# Altium project IO_Driver1616.PrjPCB
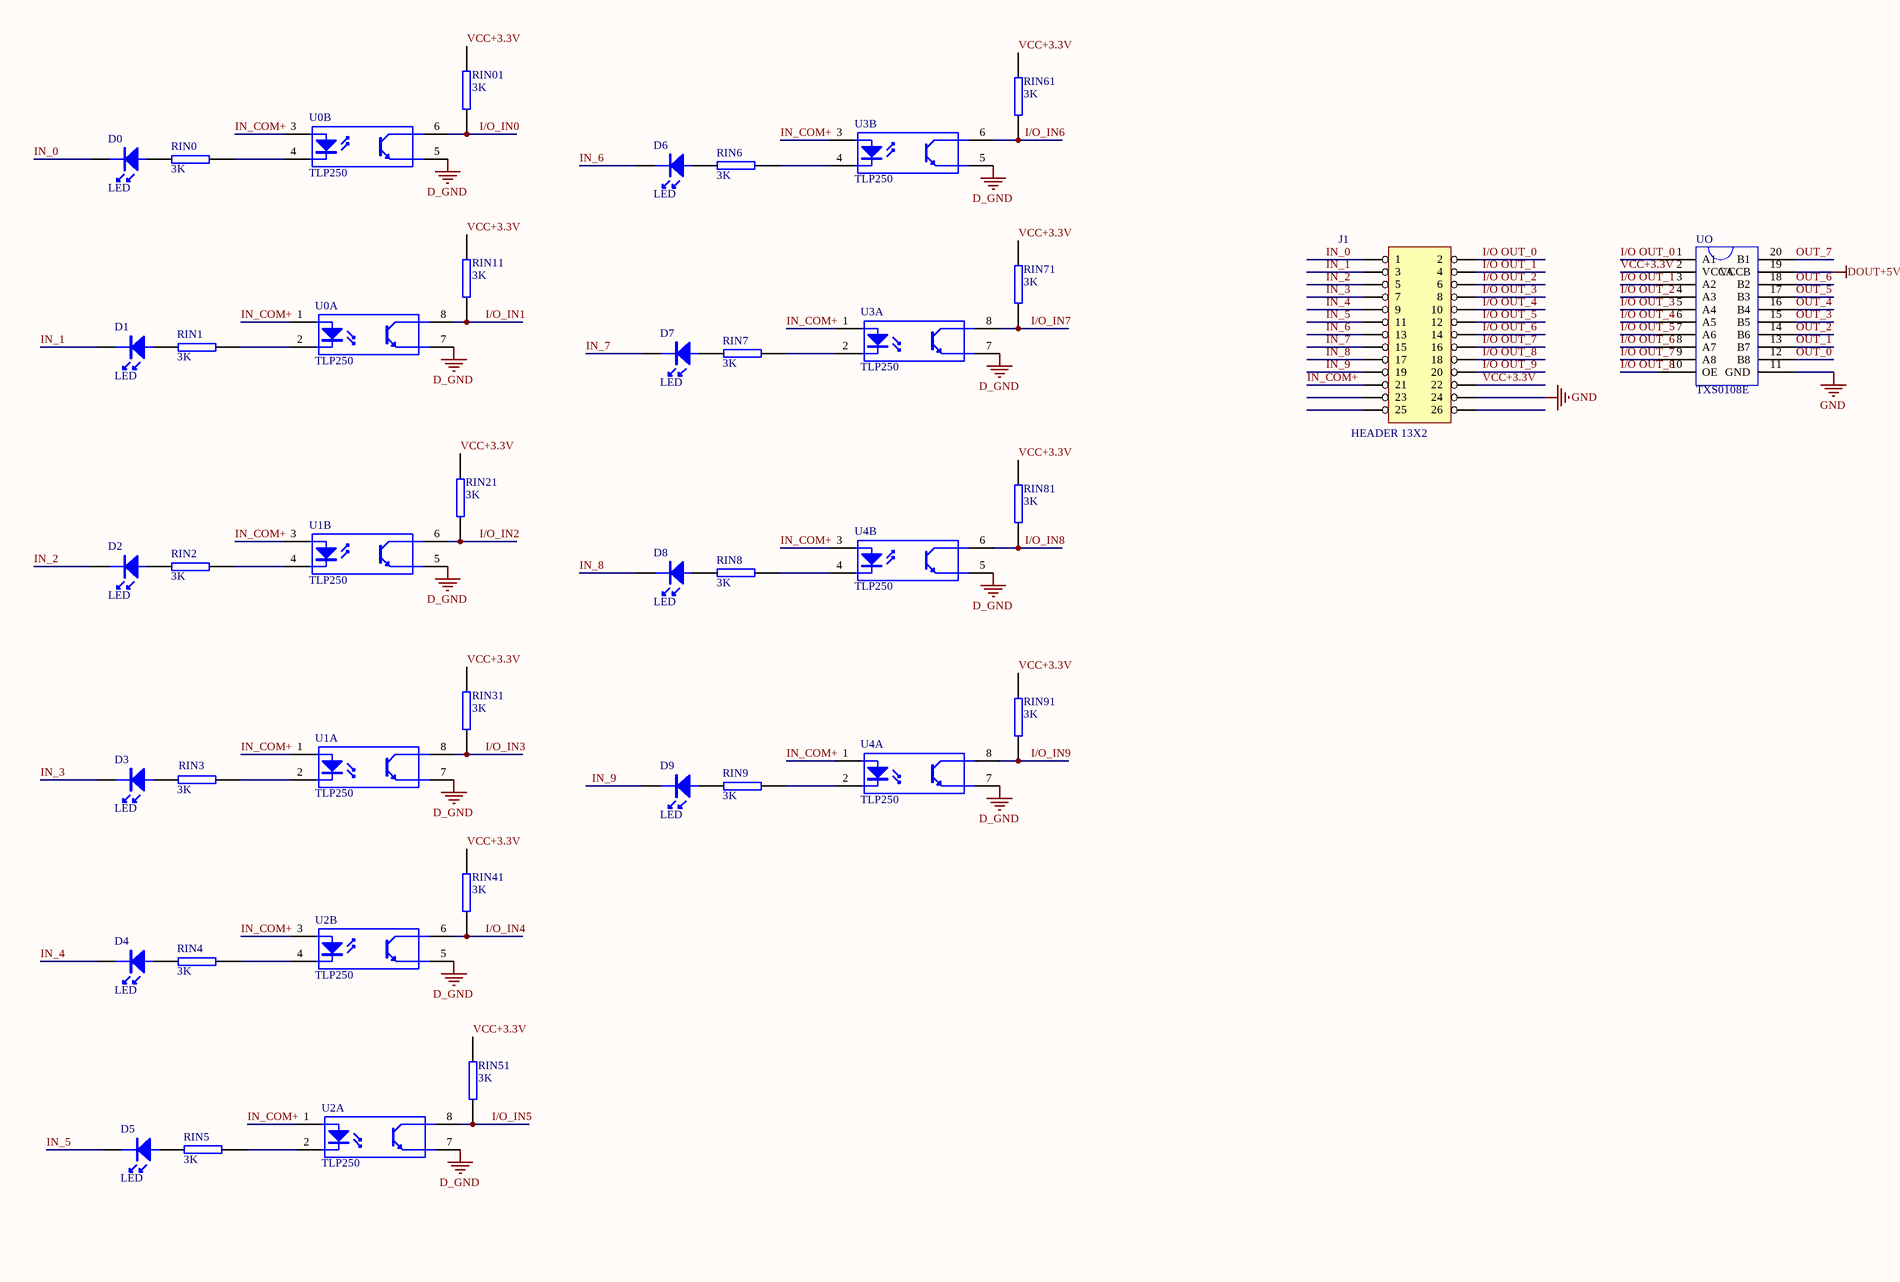
[diagram p0: IO_Driver1616.SchDoc, left]
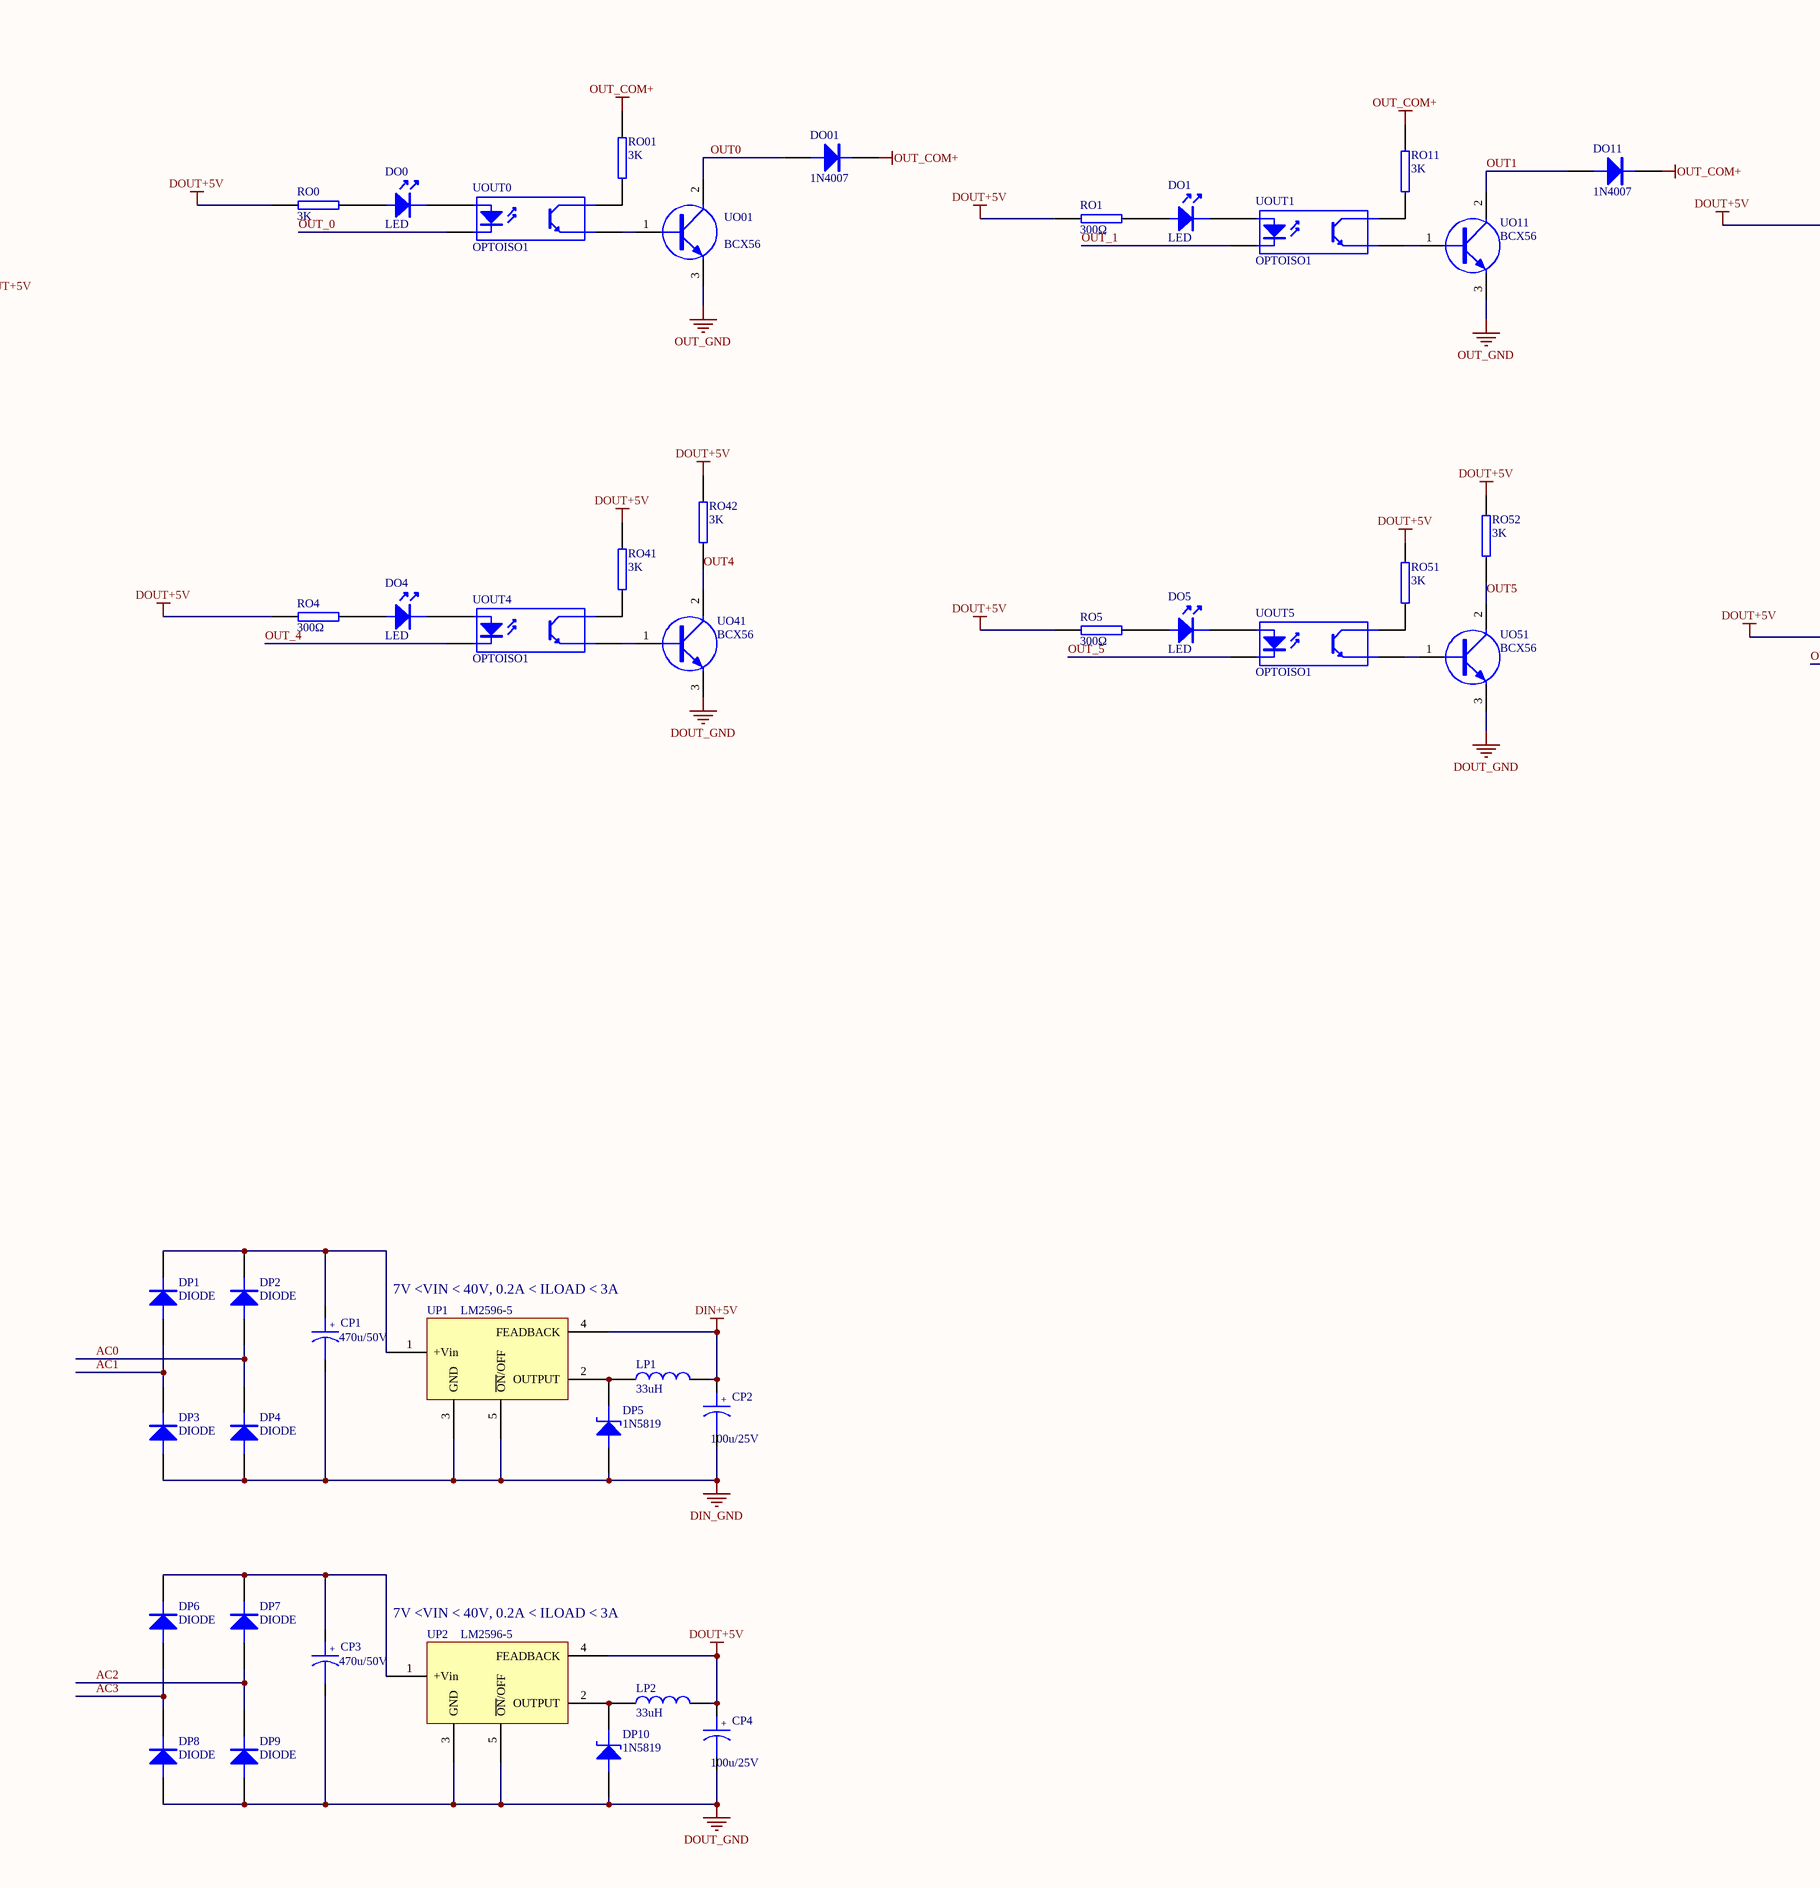
[diagram p1: IO_Driver1616.SchDoc, middle]
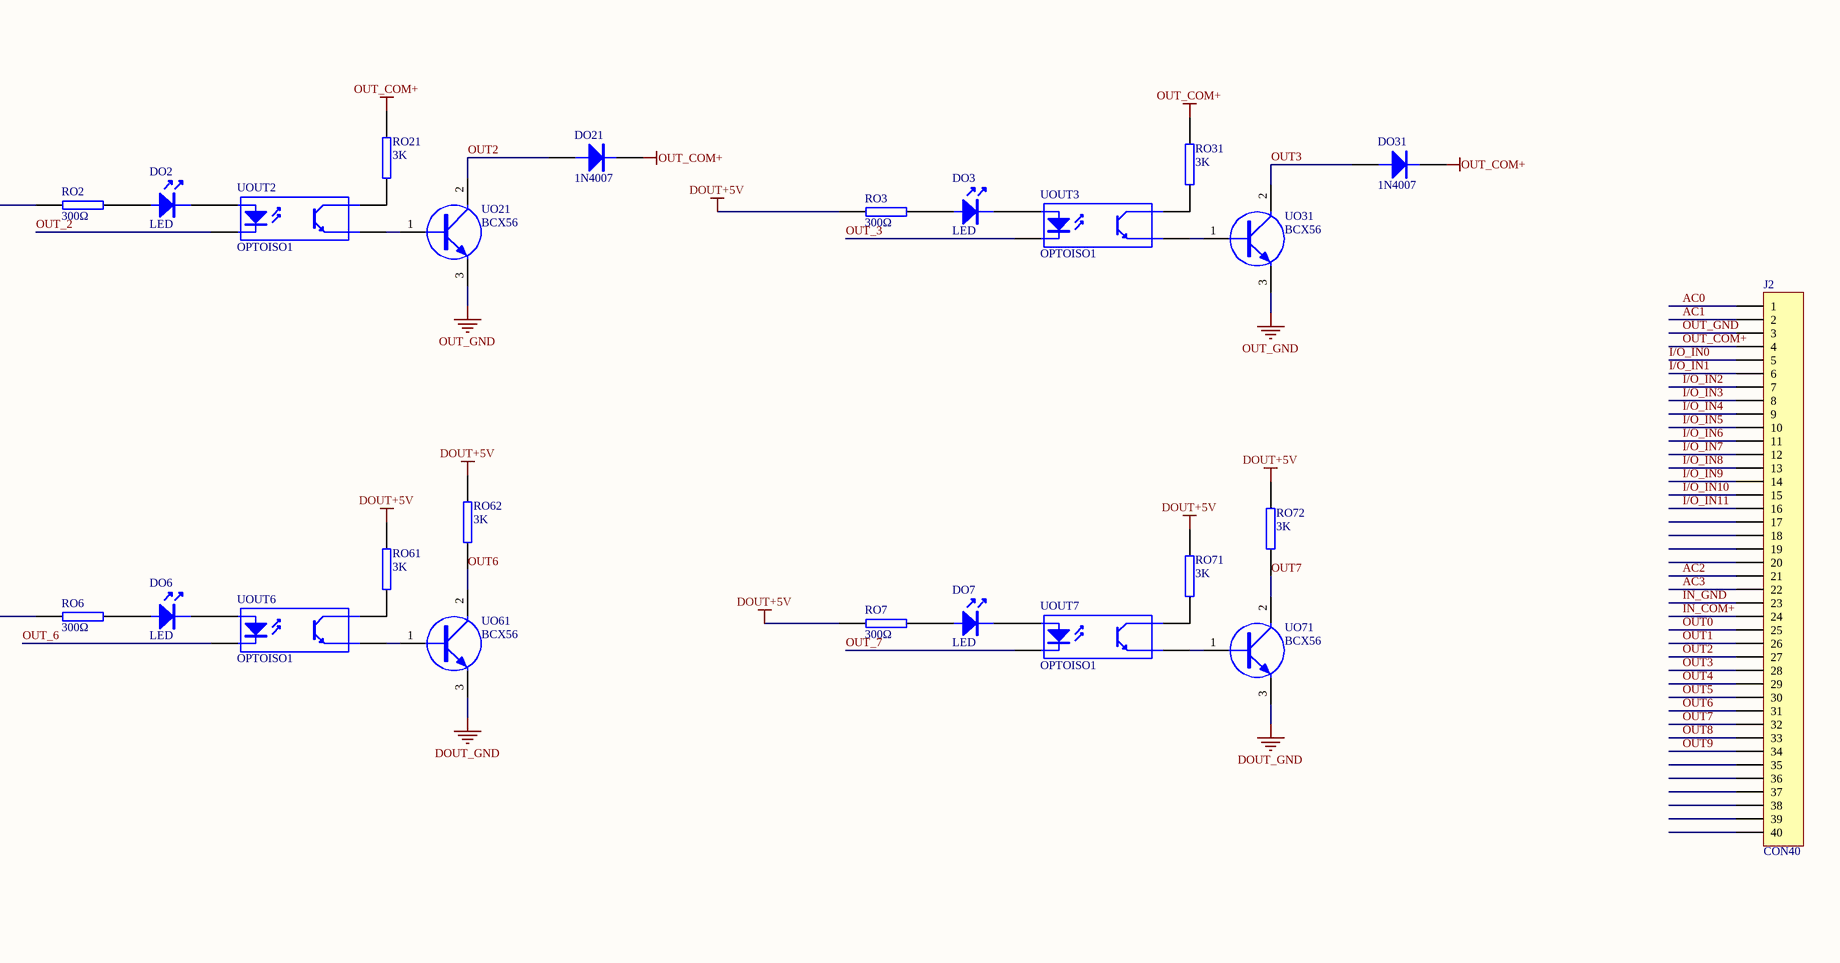
[diagram p2: IO_Driver1616.SchDoc, right]
1 sheet, 104 parts. Net scope: global (net labels, ports and power ports of the same name join across sheets).
Board file: IO_Driver1616.PcbDoc

## Sheet IO_Driver1616.SchDoc
size A0

### Parts
CP1  470u/50V  [RB.2/.4]
CP2  100u/25V  [7343]
CP3  470u/50V  [RB.2/.4]
CP4  100u/25V  [7343]
D0  LED  [LED-1]
D1  LED  [LED-1]
D2  LED  [LED-1]
D3  LED  [LED-1]
D4  LED  [LED-1]
D5  LED  [LED-1]
D6  LED  [LED-1]
D7  LED  [LED-1]
D8  LED  [LED-1]
D9  LED  [LED-1]
DO0  LED  [LED-1]
DO01  1N4007  [sma]
DO1  LED  [LED-1]
DO2  LED  [LED-1]
DO3  LED  [LED-1]
DO4  LED  [LED-1]
DO5  LED  [LED-1]
DO6  LED  [LED-1]
DO7  LED  [LED-1]
DO11  1N4007  [sma]
DO21  1N4007  [sma]
DO31  1N4007  [sma]
DP1  DIODE  [4007]
DP2  DIODE  [4007]
DP3  DIODE  [4007]
DP4  DIODE  [4007]
DP5  1N5819  [sma]
DP6  DIODE  [4007]
DP7  DIODE  [4007]
DP8  DIODE  [4007]
DP9  DIODE  [4007]
DP10  1N5819  [sma]
J1  HEADER 13X2  [IDC26 -2.0]
J2  CON40  [KF7.62-40p]
LP1  33uH  [L-5×5]
LP2  33uH  [L-5*5]
RIN0  3K  [0805]
RIN1  3K  [0805]
RIN01  3K  [0805]
RIN2  3K  [0805]
RIN3  3K  [0805]
RIN4  3K  [0805]
RIN5  3K  [0805]
RIN6  3K  [0805]
RIN7  3K  [0805]
RIN8  3K  [0805]
RIN9  3K  [0805]
RIN11  3K  [0805]
RIN21  3K  [0805]
RIN31  3K  [0805]
RIN41  3K  [0805]
RIN51  3K  [0805]
RIN61  3K  [0805]
RIN71  3K  [0805]
RIN81  3K  [0805]
RIN91  3K  [0805]
RO0  3K  [0805]
RO01  3K  [0805]
RO1  300Ω  [0805]
RO2  300Ω  [0805]
RO3  300Ω  [0805]
RO4  300Ω  [0805]
RO5  300Ω  [0805]
RO6  300Ω  [0805]
RO7  300Ω  [0805]
RO11  3K  [0805]
RO21  3K  [0805]
RO31  3K  [0805]
RO41  3K  [0805]
RO42  3K  [0805]
RO51  3K  [0805]
RO52  3K  [0805]
RO61  3K  [0805]
RO62  3K  [0805]
RO71  3K  [0805]
RO72  3K  [0805]
U0  TLP250  [DIP8]  (parts A,B of 2)
U1  TLP250  [DIP8]  (parts A,B of 2)
U2  TLP250  [DIP8]  (parts A,B of 2)
U3  TLP250  [DIP8]  (parts A,B of 2)
U4  TLP250  [DIP8]  (parts A,B of 2)
UO  TXS0108E  [TXS0108E]
UO01  BCX56  [SOP-89]
UO11  BCX56  [SOP-89]
UO21  BCX56  [SOP-89]
UO31  BCX56  [SOP-89]
UO41  BCX56  [SOP-89]
UO51  BCX56  [SOP-89]
UO61  BCX56  [SOP-89]
UO71  BCX56  [SOP-89]
UOUT0  OPTOISO1  [SO4]
UOUT1  OPTOISO1  [SO4]
UOUT2  OPTOISO1  [SO4]
UOUT3  OPTOISO1  [SO4]
UOUT4  OPTOISO1  [SO4]
UOUT5  OPTOISO1  [SO4]
UOUT6  OPTOISO1  [SO4]
UOUT7  OPTOISO1  [SO4]
UP1  LM2596-5  [HRP5]
UP2  LM2596-5  [HRP5]

### Nets
D_GND: U0.5(E) U0.7(E) U1.5(E) U1.7(E) U2.5(E) U2.7(E) U3.5(E) U3.7(E) U4.5(E) U4.7(E)
DIN+5V: CP2.1 LP1.2 UP1.4(FEADBACK)
DIN_GND: CP1.2 CP2.2 DP3.1 DP4.1 DP5.1(A) UP1.3(GND) UP1.5(~{ON}/OFF)
DOUT+5V: CP4.1 LP2.2 RO0.1 RO1.1 RO2.1 RO3.1 RO4.1 RO5.1 RO6.1 RO7.1 RO41.1 RO42.1 RO61.1 RO62.1 RO71.1 RO72.1 UO.19(VCCB) UP2.4(FEADBACK)
DOUT_GND: CP3.2 CP4.2 DP8.1 DP9.1 DP10.1(A) UO41.3(E) UO51.3(E) UO61.3(E) UO71.3(E) UP2.3(GND) UP2.5(~{ON}/OFF)
GND: J1.24 UO.11(GND)
OUT_COM+: DO01.2 DO11.2 DO21.2 DO31.2 J2.4 RO01.1 RO11.1 RO21.1 RO31.1
OUT_GND: J2.3 UO01.3(E) UO11.3(E) UO21.3(E) UO31.3(E)
AC0: DP2.1 DP4.2 J2.1
AC1: DP1.1 DP3.2 J2.2
AC2: DP7.1 DP9.2 J2.21
AC3: DP6.1 DP8.2 J2.22
I/O OUT_0: J1.2 UO.1(A1)
I/O OUT_1: J1.4 UO.3(A2)
I/O OUT_2: J1.6 UO.4(A3)
I/O OUT_3: J1.8 UO.5(A4)
I/O OUT_4: J1.10 UO.6(A5)
I/O OUT_5: J1.12 UO.7(A6)
I/O OUT_6: J1.14 UO.8(A7)
I/O OUT_7: J1.16 UO.9(A8)
I/O OUT_8: J1.18 UO.10(OE)
I/O OUT_9: J1.20
I/O_IN0: J2.5 RIN01.2 U0.6(C)
I/O_IN1: J2.6 RIN11.2 U0.8(C)
I/O_IN2: J2.7 RIN21.2 U1.6(C)
I/O_IN3: J2.8 RIN31.2 U1.8(C)
I/O_IN4: J2.9 RIN41.2 U2.6(C)
I/O_IN5: J2.10 RIN51.2 U2.8(C)
I/O_IN6: J2.11 RIN61.2 U3.6(C)
I/O_IN7: J2.12 RIN71.2 U3.8(C)
I/O_IN8: J2.13 RIN81.2 U4.6(C)
I/O_IN9: J2.14 RIN91.2 U4.8(C)
I/O_IN10: J2.15
I/O_IN11: J2.16
IN_0: D0.2 J1.1
IN_1: D1.2 J1.3
IN_2: D2.2 J1.5
IN_3: D3.2 J1.7
IN_4: D4.2 J1.9
IN_5: D5.2 J1.11
IN_6: D6.2 J1.13
IN_7: D7.2 J1.15
IN_8: D8.2 J1.17
IN_9: D9.2 J1.19
IN_COM+: J1.21 J2.24 U0.1(A) U0.3(A) U1.1(A) U1.3(A) U2.1(A) U2.3(A) U3.1(A) U3.3(A) U4.1(A) U4.3(A)
IN_GND: J2.23
OUT0: DO01.1 J2.25 UO01.2(C)
OUT1: DO11.1 J2.26 UO11.2(C)
OUT2: DO21.1 J2.27 UO21.2(C)
OUT3: DO31.1 J2.28 UO31.2(C)
OUT4: J2.29 RO42.2 UO41.2(C)
OUT5: J2.30 RO52.2 UO51.2(C)
OUT6: J2.31 RO62.2 UO61.2(C)
OUT7: J2.32 RO72.2 UO71.2(C)
OUT8: J2.33
OUT9: J2.34
OUT_0: UO.12(B8) UOUT0.2(K)
OUT_1: UO.13(B7) UOUT1.2(K)
OUT_2: UO.14(B6) UOUT2.2(K)
OUT_3: UO.15(B5) UOUT3.2(K)
OUT_4: UO.16(B4) UOUT4.2(K)
OUT_5: UO.17(B3) UOUT5.2(K)
OUT_6: UO.18(B2) UOUT6.2(K)
OUT_7: UO.20(B1) UOUT7.2(K)
VCC+3.3V: J1.22 RIN01.1 RIN11.1 RIN21.1 RIN31.1 RIN41.1 RIN51.1 RIN61.1 RIN71.1 RIN81.1 RIN91.1 UO.2(VCCA)
NetCP1_1: CP1.1 DP1.2 DP2.2 UP1.1(+Vin)
NetCP3_1: CP3.1 DP6.2 DP7.2 UP2.1(+Vin)
NetD0_1: D0.1 RIN0.2
NetD1_1: D1.1 RIN1.2
NetD2_1: D2.1 RIN2.2
NetD3_1: D3.1 RIN3.2
NetD4_1: D4.1 RIN4.2
NetD5_1: D5.1 RIN5.2
NetD6_1: D6.1 RIN6.2
NetD7_1: D7.1 RIN7.2
NetD8_1: D8.1 RIN8.2
NetD9_1: D9.1 RIN9.2
NetDO0_1: DO0.1 RO0.2
NetDO0_2: DO0.2 UOUT0.1(A)
NetDO1_1: DO1.1 RO1.2
NetDO1_2: DO1.2 UOUT1.1(A)
NetDO2_1: DO2.1 RO2.2
NetDO2_2: DO2.2 UOUT2.1(A)
NetDO3_1: DO3.1 RO3.2
NetDO3_2: DO3.2 UOUT3.1(A)
NetDO4_1: DO4.1 RO4.2
NetDO4_2: DO4.2 UOUT4.1(A)
NetDO5_1: DO5.1 RO5.2
NetDO5_2: DO5.2 UOUT5.1(A)
NetDO6_1: DO6.1 RO6.2
NetDO6_2: DO6.2 UOUT6.1(A)
NetDO7_1: DO7.1 RO7.2
NetDO7_2: DO7.2 UOUT7.1(A)
NetDP5_2: DP5.2(K) LP1.1 UP1.2(OUTPUT)
NetDP10_2: DP10.2(K) LP2.1 UP2.2(OUTPUT)
NetRIN0_1: RIN0.1 U0.4(K)
NetRIN1_1: RIN1.1 U0.2(K)
NetRIN2_1: RIN2.1 U1.4(K)
NetRIN3_1: RIN3.1 U1.2(K)
NetRIN4_1: RIN4.1 U2.4(K)
NetRIN5_1: RIN5.1 U2.2(K)
NetRIN6_1: RIN6.1 U3.4(K)
NetRIN7_1: RIN7.1 U3.2(K)
NetRIN8_1: RIN8.1 U4.4(K)
NetRIN9_1: RIN9.1 U4.2(K)
NetRO01_2: RO01.2 UOUT0.4(C)
NetRO11_2: RO11.2 UOUT1.4(C)
NetRO21_2: RO21.2 UOUT2.4(C)
NetRO31_2: RO31.2 UOUT3.4(C)
NetRO41_2: RO41.2 UOUT4.4(C)
NetRO51_2: RO51.2 UOUT5.4(C)
NetRO61_2: RO61.2 UOUT6.4(C)
NetRO71_2: RO71.2 UOUT7.4(C)
NetUO01_1: UO01.1(B) UOUT0.3(E)
NetUO11_1: UO11.1(B) UOUT1.3(E)
NetUO21_1: UO21.1(B) UOUT2.3(E)
NetUO31_1: UO31.1(B) UOUT3.3(E)
NetUO41_1: UO41.1(B) UOUT4.3(E)
NetUO51_1: UO51.1(B) UOUT5.3(E)
NetUO61_1: UO61.1(B) UOUT6.3(E)
NetUO71_1: UO71.1(B) UOUT7.3(E)

Not connected (* = marked no-connect by the designer): J1 23 25 26; J2 17 18 19 20 35 36 37 38 39 40; RO51 1; RO52 1

### Notes on the sheet
- (near UP1) 7V <VIN < 40V, 0.2A < ILOAD < 3A
- (near UP2) 7V <VIN < 40V, 0.2A < ILOAD < 3A
- Labels drawn without touching a wire or pin: DOUT+5V
- (in symbol CAPACITOR POL) +

### Library data of the parts
CP1-CP4 = CAPACITOR POL
DO01 DO11 DO21 DO31 = DIODE
DP5 DP10 = ZENER2: Zener Diode
LP1 LP2 = INDUCTOR
RIN0 RIN1 RIN01-RIN9 RIN11 RIN21 RIN31 RIN41 RIN51 RIN61 RIN71 RIN81 RIN91 RO0 RO01 RO1-RO7 RO11 RO21 RO31 RO41 RO42 RO51 RO52 RO61 RO62 RO71 RO72 = RES2
U0-U4 = TLP250: Optoisolator
UOUT0-UOUT7 = OPTOISO1: Optoisolator